# Altium schematic sheet Esquematico.SchDoc
size A4; SheetNumber: 1; SheetTotal: 1
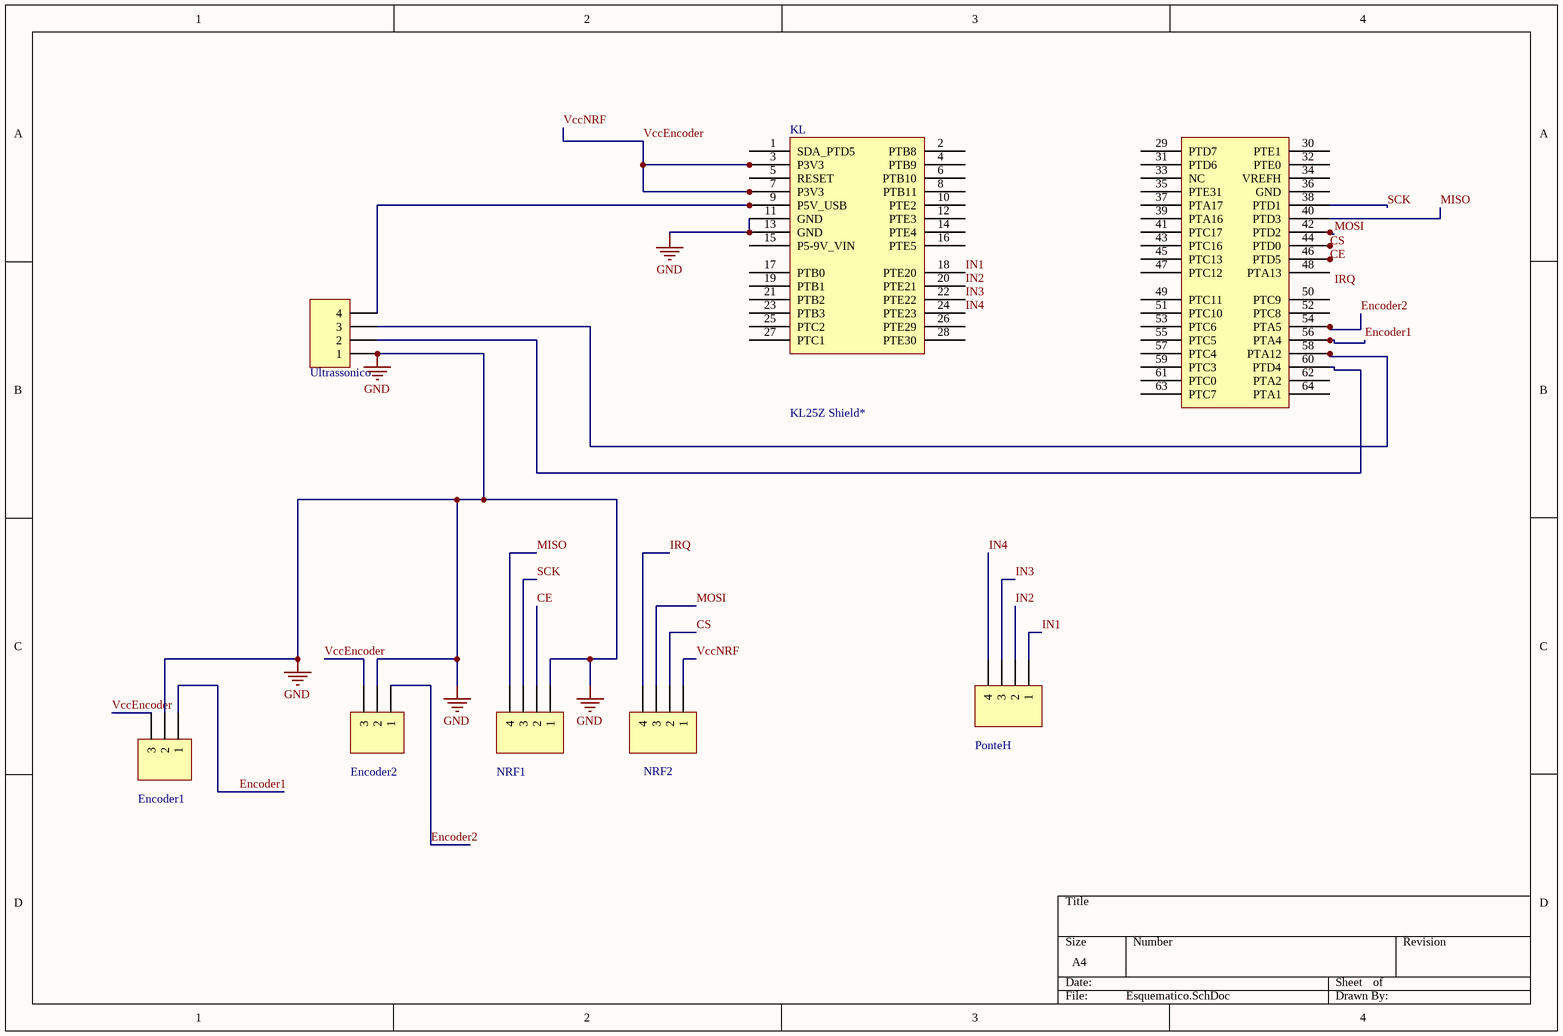
[diagram p0: Esquematico.SchDoc]

## Parts
Encoder1  Header 1x3  [HDR FEMALE 1x3]  (value not drawn)
Encoder2  Header 1x3  [HDR FEMALE 1x3]  (value not drawn)
KL  KL25Z Shield*  [Freedom KL25Z Headerarray]
NRF1  Header Female 1x4  [HDR FEMALE 1x4]  (value not drawn)
NRF2  Header Female 1x4  [HDR FEMALE 1x4]  (value not drawn)
PonteH  Header Female 1x4  [HDR FEMALE 1x4]  (value not drawn)
Ultrassonico  Header Female 1x4  [HDR FEMALE 1x4]  (value not drawn)

## Nets
GND: Encoder1.2 Encoder2.2 KL.11(GND) KL.13(GND) NRF1.1 Ultrassonico.1
CE: KL.46(PTD5) NRF1.2
CS: KL.44(PTD0) NRF2.2
Encoder1: Encoder1.1 KL.56(PTA4)
Encoder2: Encoder2.1 KL.54(PTA5)
IN1: KL.18(PTE20) PonteH.1
IN2: KL.20(PTE21) PonteH.2
IN3: KL.22(PTE22) PonteH.3
IN4: KL.24(PTE23) PonteH.4
IRQ: NRF2.4
MISO: KL.40(PTD3) NRF1.4
MOSI: KL.42(PTD2) NRF2.3
SCK: KL.38(PTD1) NRF1.3
VccEncoder: Encoder1.3 Encoder2.3 KL.3(P3V3) KL.7(P3V3) NRF2.1  [also labelled VccNRF]
NetKL_9: KL.9(P5V_USB) Ultrassonico.4
NetKL_58: KL.58(PTA12) Ultrassonico.3
NetKL_60: KL.60(PTD4) Ultrassonico.2

Not connected (* = marked no-connect by the designer): KL 1(SDA_PTD5) 2(PTB8) 4(PTB9) 5(RESET) 6(PTB10) 8(PTB11) 10(PTE2) 12(PTE3) 14(PTE4) 15(P5-9V_VIN) 16(PTE5) 17(PTB0) 19(PTB1) 21(PTB2) 23(PTB3) 25(PTC2) 26(PTE29) 27(PTC1) 28(PTE30) 29(PTD7) 30(PTE1) 31(PTD6) 32(PTE0) 33(NC) 34(VREFH) 35(PTE31) 36(GND) 37(PTA17) 39(PTA16) 41(PTC17) 43(PTC16) 45(PTC13) 47(PTC12) 48(PTA13) 49(PTC11) 50(PTC9) 51(PTC10) 52(PTC8) 53(PTC6) 55(PTC5) 57(PTC4) 59(PTC3) 61(PTC0) 62(PTA2) 63(PTC7) 64(PTA1)

## Notes on the sheet
- Labels drawn without touching a wire or pin: IRQ

## Library data of the parts
Encoder1 Encoder2 = Header 1x3: Headers & Wire Housings 40Pin 2mm Spacing Single Row Hdrs, 5pc; Manufacturer: Cromax; Manufacturer Part Number: IMP10327; Mounting Angle: Vertical; Number of Positions: 40 Position; Supplier 1: Mult Comercial; RoHS: RoHS Compliant; Category: Headers & Wire Housings; Stock 1: 14; Pricing 1: 1=1.00, 5=0.20 (BRL); Accessory Type: -; Contact Plating: Gold; Contact Type: -; Number of Rows: 1 Row; Product: Headers; Termination Style: Through Hole; Type: Breakaway; Brand: Cromax; Mounting Style: Straight Pin; Pitch: 2 mm; Row Spacing: -; Contact Gender: Pin (Male); Product Category: Accessories; RoHS - Mouser: Y; Minimum Order Quantity: 1; Reeling: False; ComponentLink1URL: http://loja.multcomercial.com.br/barra-de-pinos-simples-1x40-macho-bmo40-1e.html; ComponentLink1Description: http://loja.multcomercial.com.br/barra-de-pinos-simples-1x40-macho-bmo40-1e.html; Supplier Part Number 1: Barra de Pinos Simples 1x40 Macho BMO40-1E
KL = Freedom KL25Z Header: FRDM KL25Z Shield; pin to pad: 1>SDA_PTD5 2>PTB8 3>P3V3 4>PTB9 5>RESET 6>PTB10 7>P3V3 8>PTB11 9>P5V_USB 10>PTE2 11>GND 12>PTE3 13>GND 14>PTE4 15>P5-9V_VIN 16>PTE5 17>PTB0 18>PTE20 19>PTB1 20>PTE21 21>PTB2 22>PTE22 23>PTB3 24>PTE23 25>PTC2 26>PTE29 27>PTC1 28>PTE30 29>PTD7 30>PTE1 31>PTD6 32>PTE0 33>NC 34>VREFH 35>PTE31 36>GND 37>PTA17 38>PTD1 39>PTA16 40>PTD3 41>PTC17 42>PTD2 43>PTC16 44>PTD0 45>PTC13 46>PTD5 47>PTC12 48>PTA13 49>PTC11 50>PTC9 51>PTC10 52>PTC8 53>PTC6 54>PTA5 55>PTC5 56>PTA4 57>PTC4 58>PTA12 59>PTC3 60>PTD4 61>PTC0 62>PTA2 63>PTC7 64>PTA1
NRF1 NRF2 PonteH Ultrassonico = Header Female 1x4: Headers & Wire Housings 40Pin 2mm Spacing Single Row Hdrs, 5pc; Manufacturer: Cromax; Mounting Angle: Vertical; Number of Positions: 40 Position; Supplier 1: -; Manufacturer Part Number: -; RoHS: RoHS Compliant; Category: Headers & Wire Housings; Stock 1: 14; Pricing 1: 1=1.60, 5=0.32 (BRL); Accessory Type: -; Contact Plating: Gold; Contact Type: -; Number of Rows: 1 Row; Product: Headers; Termination Style: Through Hole; Type: Breakaway; Brand: Cromax; Mounting Style: Straight Pin; Pitch: 2 mm; Row Spacing: -; Contact Gender: Pin (Female); Product Category: Accessories; RoHS - Mouser: Y; Minimum Order Quantity: 1; Reeling: False; ComponentLink1URL: -; ComponentLink1Description: -; Supplier Part Number 1: -